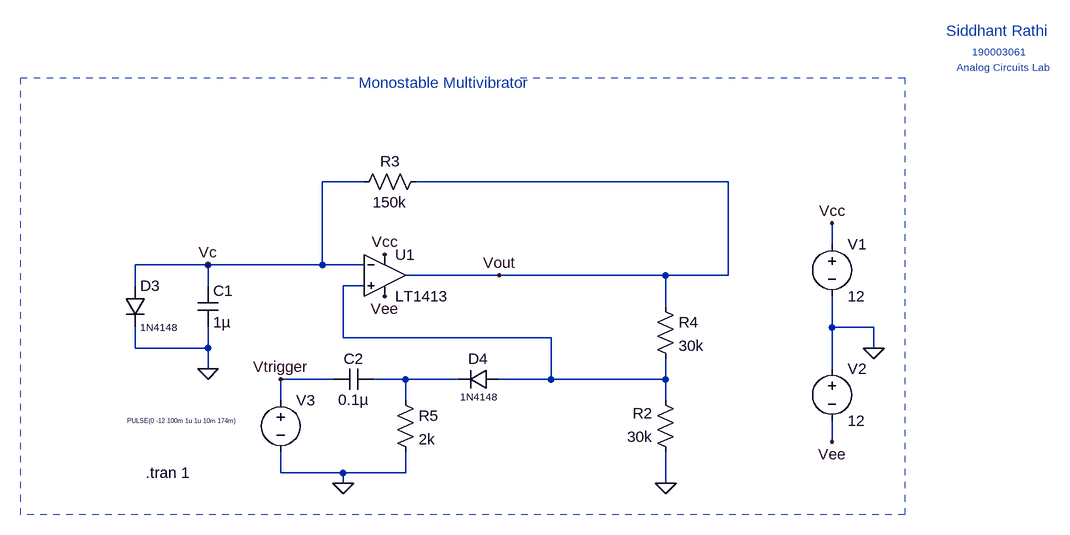
[diagram p0: schematic MonostableMultivibrator.asc]
MonostableMultivibrator.asc, the LTspice schematic file:
Version 4
SHEET 1 1780 680
WIRE 272 48 208 48
WIRE 832 48 352 48
WIRE 992 144 992 112
WIRE 32 176 -80 176
WIRE 208 176 208 48
WIRE 208 176 32 176
WIRE 272 176 208 176
WIRE 480 192 336 192
WIRE 736 192 480 192
WIRE 832 192 832 48
WIRE 832 192 736 192
WIRE -80 208 -80 176
WIRE 32 208 32 176
WIRE 272 208 240 208
WIRE 736 240 736 192
WIRE 992 272 992 224
WIRE 1056 272 992 272
WIRE 240 288 240 208
WIRE 560 288 240 288
WIRE -80 304 -80 272
WIRE 32 304 32 272
WIRE 32 304 -80 304
WIRE 1056 304 1056 272
WIRE 32 336 32 304
WIRE 992 336 992 272
WIRE 224 352 144 352
WIRE 336 352 288 352
WIRE 416 352 336 352
WIRE 560 352 560 288
WIRE 560 352 480 352
WIRE 736 352 736 320
WIRE 736 352 560 352
WIRE 144 384 144 352
WIRE 336 384 336 352
WIRE 736 384 736 352
WIRE 992 448 992 416
WIRE 144 496 144 464
WIRE 240 496 144 496
WIRE 336 496 336 464
WIRE 336 496 240 496
WIRE 240 512 240 496
WIRE 736 512 736 464
FLAG 32 336 0
FLAG 736 512 0
FLAG 1056 304 0
FLAG 992 112 Vcc
FLAG 304 160 Vcc
FLAG 992 448 Vee
FLAG 304 224 Vee
FLAG 480 192 Vout
FLAG 240 512 0
FLAG 144 352 Vtrigger
FLAG 32 176 Vc
SYMBOL voltage 992 128 R0
WINDOW 123 0 0 Left 0
WINDOW 39 0 0 Left 0
SYMATTR InstName V1
SYMATTR Value 12
SYMBOL voltage 992 320 R0
WINDOW 123 0 0 Left 0
WINDOW 39 0 0 Left 0
SYMATTR InstName V2
SYMATTR Value 12
SYMBOL res 752 480 R180
WINDOW 0 36 76 Left 2
WINDOW 3 36 40 Left 2
SYMATTR InstName R2
SYMATTR Value 30k
SYMBOL cap 16 208 R0
SYMATTR InstName C1
SYMATTR Value 1µ
SYMBOL res 368 32 R90
WINDOW 0 0 56 VBottom 2
WINDOW 3 32 56 VTop 2
SYMATTR InstName R3
SYMATTR Value 150k
SYMBOL res 720 224 R0
SYMATTR InstName R4
SYMATTR Value 30k
SYMBOL diode -96 208 R0
WINDOW 3 24 64 Left 1
SYMATTR Value 1N4148
SYMATTR InstName D3
SYMBOL diode 480 336 R90
WINDOW 0 0 32 VBottom 2
WINDOW 3 32 32 VTop 1
SYMATTR InstName D4
SYMATTR Value 1N4148
SYMBOL res 320 368 R0
SYMATTR InstName R5
SYMATTR Value 2k
SYMBOL cap 288 336 R90
WINDOW 0 0 32 VBottom 2
WINDOW 3 32 32 VTop 2
SYMATTR InstName C2
SYMATTR Value 0.1µ
SYMBOL voltage 144 368 R0
WINDOW 3 -236 48 Left 0
WINDOW 123 0 0 Left 0
WINDOW 39 0 0 Left 0
SYMATTR Value PULSE(0 -12 100m 1u 1u 10m 174m)
SYMATTR InstName V3
SYMBOL OpAmps\\LT1413 304 128 R0
SYMATTR InstName U1
TEXT -64 496 Left 2 !.tran 1
TEXT 264 -104 Left 2 ;Monostable Multivibrator
TEXT 1168 -184 Left 2 ;Siddhant Rathi
TEXT 1208 -152 Left 1 ;190003061
TEXT 1184 -128 Left 1 ;Analog Circuits Lab
LINE Normal -256 -112 256 -112 2
LINE Normal -256 560 -256 -112 2
LINE Normal 1104 560 -256 560 2
LINE Normal 1104 -112 1104 560 2
LINE Normal 512 -112 1104 -112 2

The netlist it stands for:
* MonostableMultivibrator.asc
V1 Vcc 0 12
V2 0 Vee 12
R2 0 N001 30k
C1 Vc 0 1µ
R3 Vout Vc 150k
R4 Vout N001 30k
D3 Vc 0 1N4148
D4 N001 N002 1N4148
R5 N002 0 2k
C2 N002 Vtrigger 0.1µ
V3 Vtrigger 0 PULSE(0 -12 100m 1u 1u 10m 174m)
XU1 N001 Vc Vcc Vee Vout LT1413  ; pins In+ In- V+ V- OUT
.model D D
.lib standard.dio
.tran 1
* Monostable Multivibrator
* Siddhant Rathi
* 190003061
* Analog Circuits Lab
.lib LTC.lib
.backanno
.end